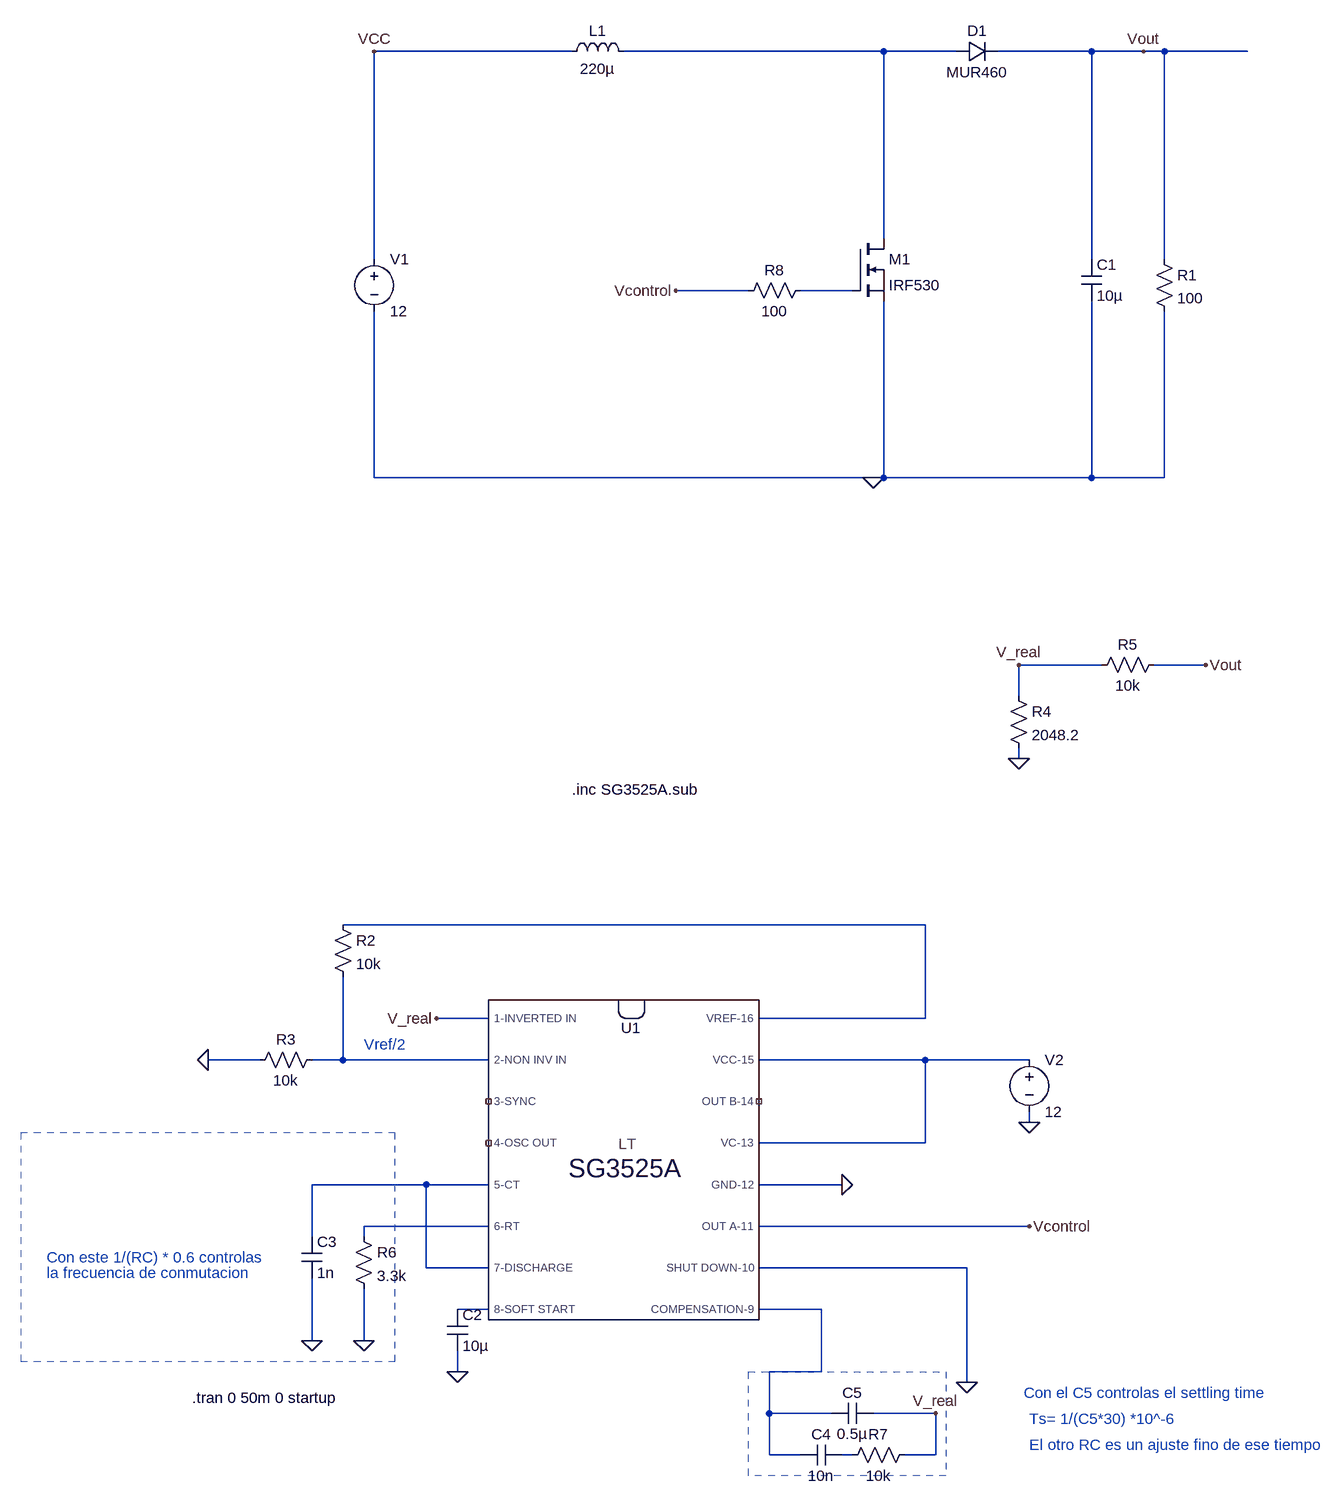
[diagram p0: schematic Boost.asc]
Boost.asc, the LTspice schematic file:
Version 4
SHEET 1 1204 2048
WIRE -208 -160 -512 -160
WIRE 272 -160 -128 -160
WIRE 384 -160 272 -160
WIRE 592 -160 448 -160
WIRE 672 -160 592 -160
WIRE 704 -160 672 -160
WIRE 832 -160 704 -160
WIRE 272 128 272 -160
WIRE -512 160 -512 -160
WIRE 592 160 592 -160
WIRE 704 160 704 -160
WIRE 64 208 -48 208
WIRE 224 208 144 208
WIRE -512 496 -512 240
WIRE 256 496 -512 496
WIRE 272 496 272 224
WIRE 272 496 256 496
WIRE 592 496 592 224
WIRE 592 496 272 496
WIRE 704 496 704 240
WIRE 704 496 592 496
WIRE 608 784 480 784
WIRE 768 784 688 784
WIRE 480 832 480 784
WIRE 480 928 480 912
WIRE 336 1184 -560 1184
WIRE -336 1328 -416 1328
WIRE 336 1328 336 1184
WIRE 336 1328 80 1328
WIRE -688 1392 -768 1392
WIRE -560 1392 -560 1264
WIRE -560 1392 -608 1392
WIRE -336 1392 -560 1392
WIRE 336 1392 80 1392
WIRE 496 1392 336 1392
WIRE 496 1488 496 1472
WIRE 336 1520 336 1392
WIRE 336 1520 80 1520
WIRE -432 1584 -608 1584
WIRE -336 1584 -432 1584
WIRE 208 1584 80 1584
WIRE -336 1648 -528 1648
WIRE 496 1648 80 1648
WIRE -608 1664 -608 1584
WIRE -528 1664 -528 1648
WIRE -432 1712 -432 1584
WIRE -336 1712 -432 1712
WIRE 400 1712 80 1712
WIRE -336 1776 -384 1776
WIRE 176 1776 80 1776
WIRE -608 1824 -608 1728
WIRE -528 1824 -528 1744
WIRE -384 1872 -384 1840
WIRE 176 1872 176 1776
WIRE 176 1872 96 1872
WIRE 400 1888 400 1712
WIRE 96 1936 96 1872
WIRE 192 1936 96 1936
WIRE 352 1936 256 1936
WIRE 96 2000 96 1936
WIRE 144 2000 96 2000
WIRE 224 2000 208 2000
WIRE 352 2000 352 1936
WIRE 352 2000 304 2000
FLAG 208 1584 0
FLAG -512 -160 VCC
FLAG 256 496 0
FLAG -768 1392 0
FLAG 480 928 0
FLAG 672 -160 Vout
FLAG 768 784 Vout
FLAG 496 1648 Vcontrol
FLAG -48 208 Vcontrol
FLAG 400 1888 0
FLAG -384 1872 0
FLAG -528 1824 0
FLAG -608 1824 0
FLAG 496 1488 0
FLAG -416 1328 V_real
FLAG 480 784 V_real
FLAG 352 1936 V_real
SYMBOL nmos 224 128 R0
SYMATTR InstName M1
SYMATTR Value IRF530
SYMBOL diode 384 -144 R270
WINDOW 0 32 32 VTop 2
WINDOW 3 0 32 VBottom 2
SYMATTR InstName D1
SYMATTR Value MUR460
SYMBOL cap 576 160 R0
SYMATTR InstName C1
SYMATTR Value 10µ
SYMBOL res 688 144 R0
SYMATTR InstName R1
SYMATTR Value 100
SYMBOL ind -224 -144 R270
WINDOW 0 32 56 VTop 2
WINDOW 3 5 56 VBottom 2
SYMATTR InstName L1
SYMATTR Value 220µ
SYMBOL voltage -512 144 R0
WINDOW 123 0 0 Left 0
WINDOW 39 0 0 Left 0
SYMATTR InstName V1
SYMATTR Value 12
SYMBOL res -576 1168 R0
SYMATTR InstName R2
SYMATTR Value 10k
SYMBOL res -592 1376 R90
WINDOW 0 0 56 VBottom 2
WINDOW 3 32 56 VTop 2
SYMATTR InstName R3
SYMATTR Value 10k
SYMBOL res 464 816 R0
SYMATTR InstName R4
SYMATTR Value 2048.2
SYMBOL res 704 768 R90
WINDOW 0 0 56 VBottom 2
WINDOW 3 32 56 VTop 2
SYMATTR InstName R5
SYMATTR Value 10k
SYMBOL cap -400 1776 R0
SYMATTR InstName C2
SYMATTR Value 10µ
SYMBOL res -544 1648 R0
SYMATTR InstName R6
SYMATTR Value 3.3k
SYMBOL cap -624 1664 R0
SYMATTR InstName C3
SYMATTR Value 1n
SYMBOL cap 208 1984 R90
WINDOW 0 0 32 VBottom 2
WINDOW 3 32 32 VTop 2
SYMATTR InstName C4
SYMATTR Value 10n
SYMBOL res 320 1984 R90
WINDOW 0 0 56 VBottom 2
WINDOW 3 32 56 VTop 2
SYMATTR InstName R7
SYMATTR Value 10k
SYMBOL cap 256 1920 R90
WINDOW 0 0 32 VBottom 2
WINDOW 3 32 32 VTop 2
SYMATTR InstName C5
SYMATTR Value 0.5µ
SYMBOL voltage 496 1376 R0
WINDOW 123 0 0 Left 0
WINDOW 39 0 0 Left 0
SYMATTR InstName V2
SYMATTR Value 12
SYMBOL res 160 192 R90
WINDOW 0 0 56 VBottom 2
WINDOW 3 32 56 VTop 2
SYMATTR InstName R8
SYMATTR Value 100
SYMBOL SG3525A -192 1424 R0
SYMATTR InstName U1
SYMATTR Value SG3525A
TEXT -528 1368 Left 2 ;Vref/2
TEXT -792 1912 Left 2 !.tran 0 50m 0 startup
TEXT -208 976 Left 2 !.inc SG3525A.sub
TEXT -1016 1696 Left 2 ;Con este 1/(RC) * 0.6 controlas
TEXT -1016 1720 Left 2 ;la frecuencia de conmutacion
TEXT 488 1904 Left 2 ;Con el C5 controlas el settling time
TEXT 496 1944 Left 2 ;Ts= 1/(C5*30) *10^-6
TEXT 496 1984 Left 2 ;El otro RC es un ajuste fino de ese tiempo
LINE Normal -480 1856 -480 1504 2
LINE Normal -1056 1856 -480 1856 2
LINE Normal -1056 1504 -1056 1856 2
LINE Normal -480 1504 -1056 1504 2
LINE Normal 64 1968 64 1872 2
LINE Normal 64 2032 64 1968 2
LINE Normal 368 2032 64 2032 2
LINE Normal 368 1872 368 2032 2
LINE Normal 64 1872 368 1872 2

The netlist it stands for:
* Boost.asc
M1 N001 N002 0 0 IRF530
D1 N001 Vout MUR460
C1 Vout 0 10µ
R1 Vout 0 100
L1 VCC N001 220µ
V1 VCC 0 12
R2 N003 N004 10k
R3 N004 0 10k
R4 V_real 0 2048.2
R5 Vout V_real 10k
C2 N008 0 10µ
R6 N007 0 3.3k
C3 N006 0 1n
C4 N010 N009 10n
R7 V_real N010 10k
C5 V_real N009 0.5µ
V2 N005 0 12
R8 N002 Vcontrol 100
XU1 V_real N004 NC_01 NC_02 N006 N007 N006 N008 N009 0 Vcontrol 0 N005 NC_03 N005 N003 SG3525A  ; pins 1-INVERTED_IN 2-NON_INV_IN 3-SYNC 4-OSC_OUT 5-CT 6-RT 7-DISCHARGE 8-SOFT_START COMPENSATION-9 SHUT_DOWN-10 OUT_A-11 GND-12 VC-13 OUT_B-14 VCC-15 VREF-16
.model D D
.lib standard.dio
.model NMOS NMOS
.model PMOS PMOS
.lib standard.mos
* Vref/2
.tran 0 50m 0 startup
.inc SG3525A.sub
* Con este 1/(RC) * 0.6 controlas
* la frecuencia de conmutacion
* Con el C5 controlas el settling time
* Ts= 1/(C5*30) *10^-6
* El otro RC es un ajuste fino de ese tiempo
.backanno
.end